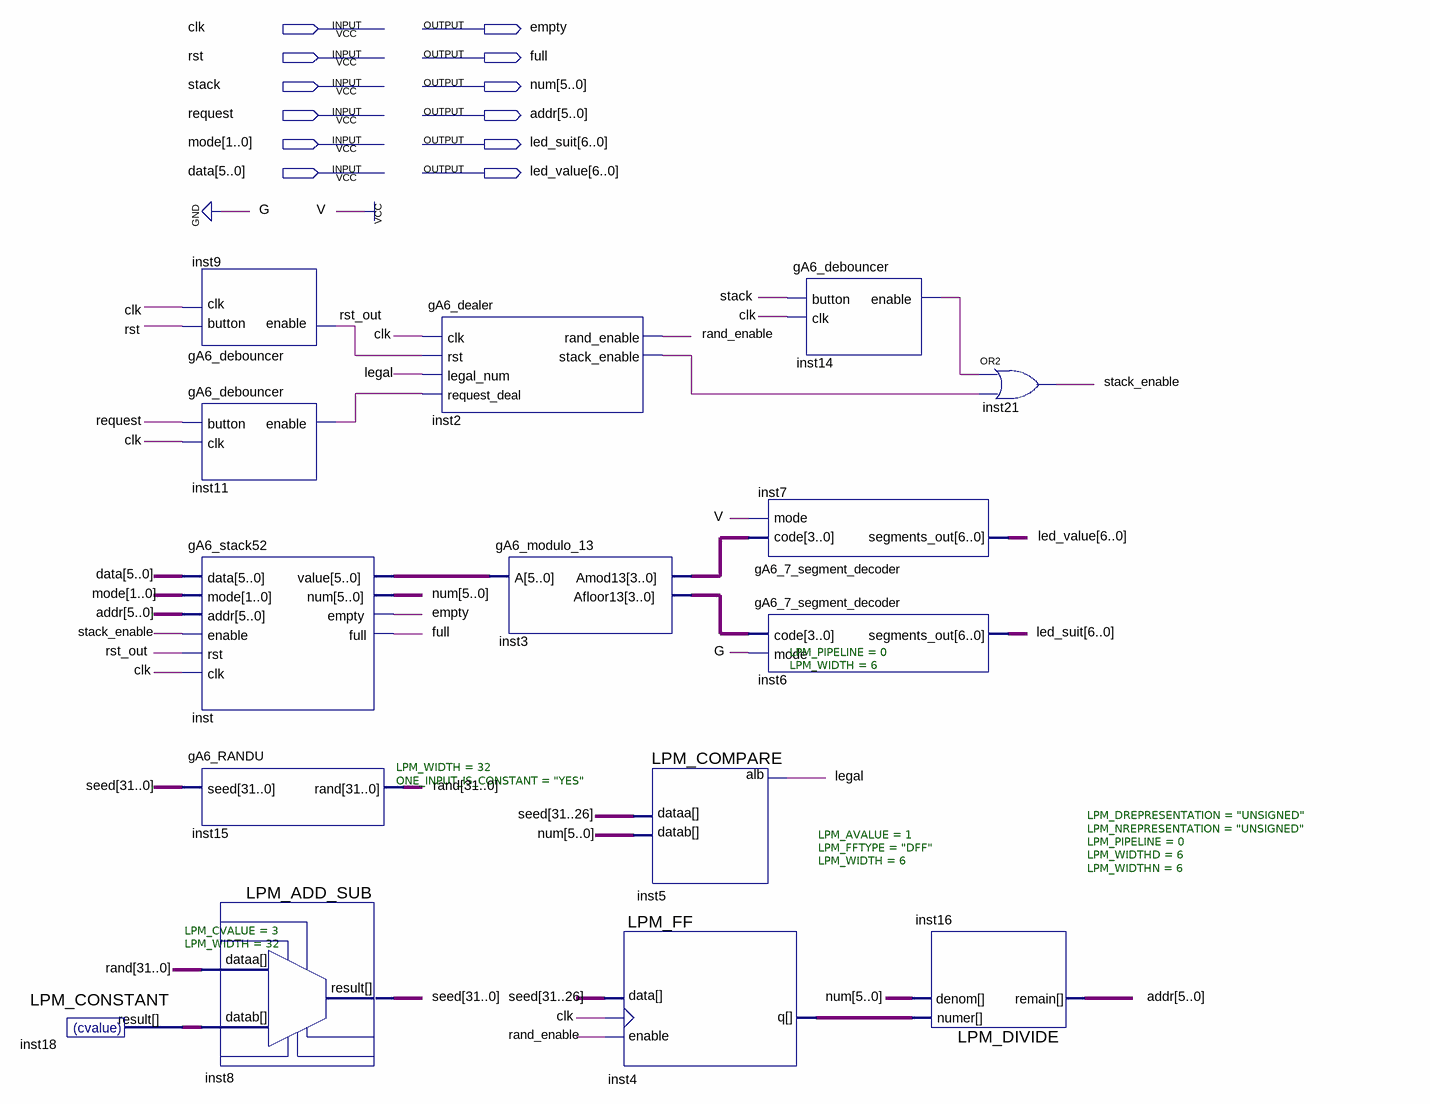
[diagram p0: schematic sheet]
// Quartus schematic gA6_testbed.bdf as structural Verilog: 15 symbols, 12 pins
module gA6_testbed (
  input  clk,
  input  rst,
  input  stack,
  input  request,
  input  [1:0] mode,
  input  [5:0] data,
  output empty,
  output full,
  output [5:0] num,
  output [5:0] addr,
  output [6:0] led_suit,
  output [6:0] led_value
);

  wire inst2_stack_enable, inst11_enable, inst14_enable, legal, rand_enable, rst_out, stack_enable;
  wire [3:0] inst3_afloor13, inst3_amod13;
  wire [5:0] inst4_q, inst_value;
  wire [31:0] inst18_result, \rand , seed;

  LPM_CONSTANT #(.LPM_CVALUE(3), .LPM_WIDTH(32)) inst18 (.result(inst18_result));
  gA6_debouncer inst9 (.button(rst), .clk(clk), .enable(rst_out));
  gA6_debouncer inst11 (.button(request), .clk(clk), .enable(inst11_enable));
  gA6_stack52 inst (
    .data(data), .mode(mode), .addr(addr), .enable(stack_enable), .rst(rst_out), .clk(clk),
    .value(inst_value), .num(num), .empty(empty), .full(full));
  gA6_RANDU inst15 (.seed(seed), .\rand (\rand ));
  LPM_ADD_SUB #(.LPM_WIDTH(32), .ONE_INPUT_IS_CONSTANT("YES")) inst8 (
    .dataa(\rand ), .datab(inst18_result), .result(seed));
  gA6_dealer inst2 (
    .clk(clk), .rst(rst_out), .legal_num(legal), .request_deal(inst11_enable), .rand_enable(rand_enable),
    .stack_enable(inst2_stack_enable));
  gA6_modulo_13 inst3 (.A(inst_value), .Amod13(inst3_amod13), .Afloor13(inst3_afloor13));
  LPM_FF #(.LPM_AVALUE(1), .LPM_FFTYPE("DFF"), .LPM_WIDTH(6)) inst4 (
    .clock(clk), .data(seed[31:26]), .enable(rand_enable), .q(inst4_q));
  LPM_COMPARE #(.LPM_PIPELINE(0), .LPM_WIDTH(6)) inst5 (.dataa(seed[31:26]), .datab(num), .alb(legal));
  gA6_7_segment_decoder inst7 (.code(inst3_amod13), .mode(1'b1), .segments_out(led_value));
  gA6_7_segment_decoder inst6 (.code(inst3_afloor13), .mode(1'b0), .segments_out(led_suit));
  gA6_debouncer inst14 (.button(stack), .clk(clk), .enable(inst14_enable));
  LPM_DIVIDE #(.LPM_DREPRESENTATION("UNSIGNED"), .LPM_NREPRESENTATION("UNSIGNED"), .LPM_PIPELINE(0), .LPM_WIDTHD(6), .LPM_WIDTHN(6)) inst16 (
    .denom(num), .numer(inst4_q), .remain(addr));
  or inst21 (stack_enable, inst14_enable, inst2_stack_enable);
endmodule
